# EAGLE design openmote32_2_0_1 (EAGLE 6.1)
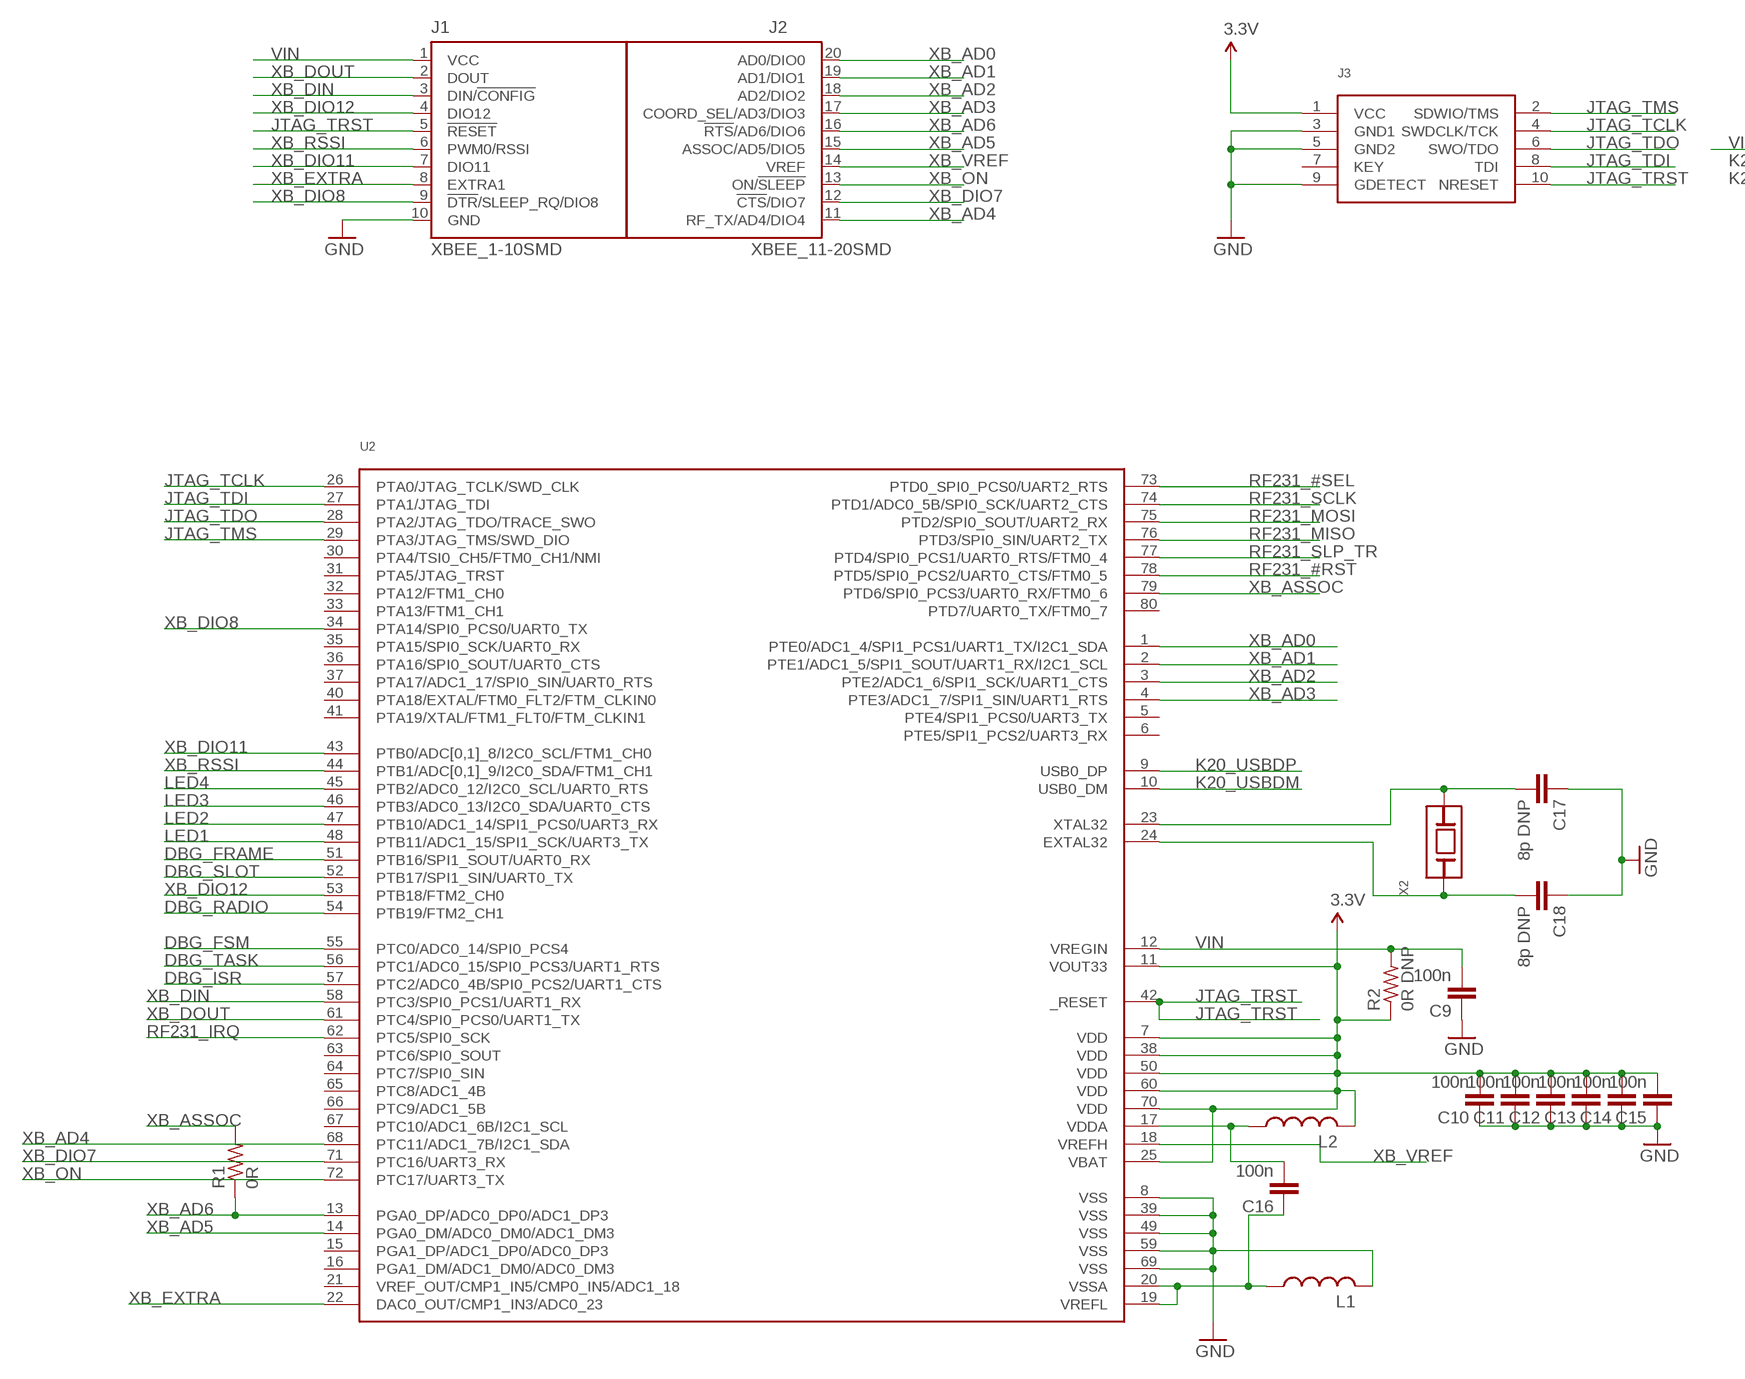
[diagram p0: schematic, sheet 1, part 1 of 2]
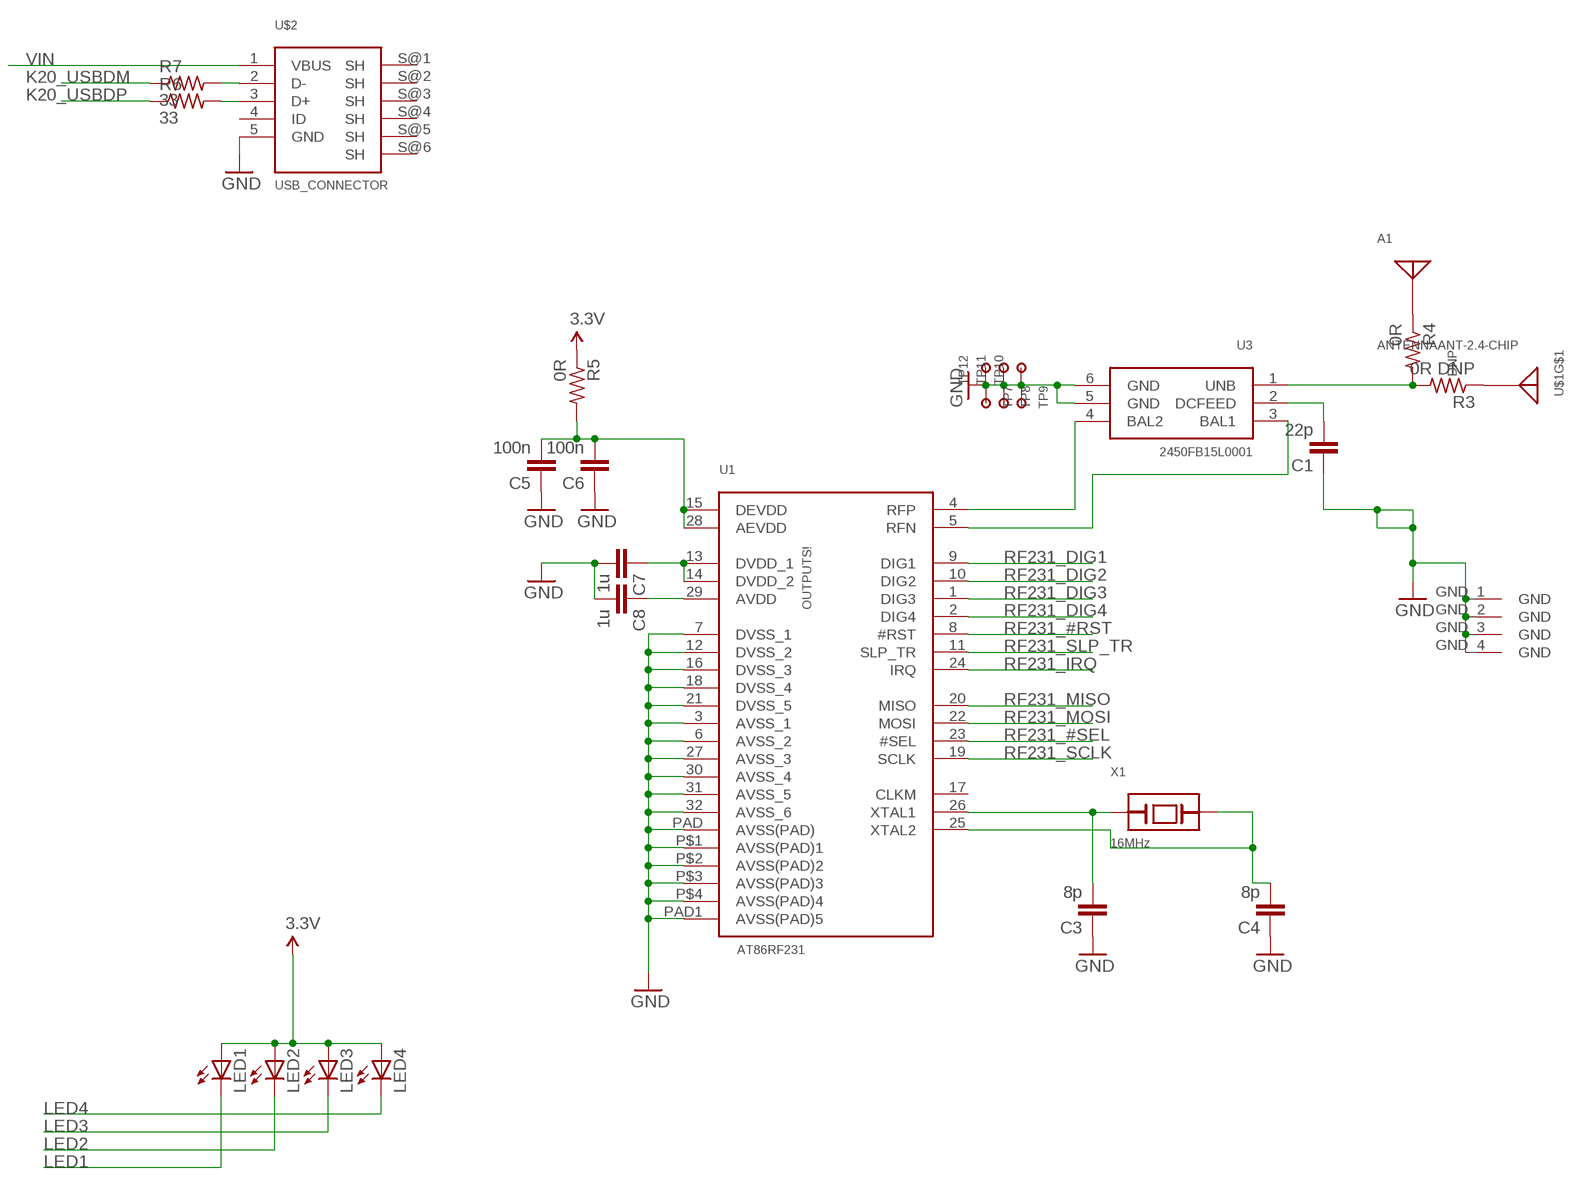
[diagram p1: schematic, sheet 1, part 2 of 2]

## Parts
A1  ANTENNAANT-2.4-CHIP  [ANT-2.4-CHP]
C1  22p  CAP0402  [C0402]
C3  8p  CAP0402  [C0402]
C4  8p  CAP0402  [C0402]
C5  100n  CAP0402  [C0402]
C6  100n  CAP0402  [C0402]
C7  1u  CAP0402  [C0402]
C8  1u  CAP0402  [C0402]
C9  100n  CAP0402  [C0402]
C10  100n  CAP0402  [C0402]
C11  100n  CAP0402  [C0402]
C12  100n  CAP0402  [C0402]
C13  100n  CAP0402  [C0402]
C14  100n  CAP0402  [C0402]
C15  100n  CAP0402  [C0402]
C16  100n  CAP0402  [C0402]
C17  8p DNP  CAP0402  [C0402]
C18  8p DNP  CAP0402  [C0402]
J1  XBEE_1-10SMD  [XBEE_1-10+SMD]
J2  XBEE_11-20SMD  [XBEE_11-20+SMD]
J3  JTAG_CONNECTOR  [SMD-050-HEADER-2X5]
L1  L-USL0402  [L0402]
L2  L-USL0402  [L0402]
LED1  LEDCHIPLED_0603  [CHIPLED_0603]
LED2  LEDCHIPLED_0603  [CHIPLED_0603]
LED3  LEDCHIPLED_0603  [CHIPLED_0603]
LED4  LEDCHIPLED_0603  [CHIPLED_0603]
R1  0R  R-US_R0402  [R0402]
R2  0R DNP  R-US_R0402  [R0402]
R3  0R DNP  R-US_R0402  [R0402]
R4  0R  R-US_R0402  [R0402]
R5  0R  R-US_R0402  [R0402]
R6  33  R-US_R0402  [R0402]
R7  33  R-US_R0402  [R0402]
TP7  TESTPOINTSMALLEST  [TESTPOINT]
TP8  TESTPOINTSMALLEST  [TESTPOINT]
TP9  TESTPOINTSMALLEST  [TESTPOINT]
TP10  TESTPOINTSMALLEST  [TESTPOINT]
TP11  TESTPOINTSMALLEST  [TESTPOINT]
TP12  TESTPOINTSMALLEST  [TESTPOINT]
U1  AT86RF231  [ATRF231_32QN2]
U2  K20_80PIN  [K20_LQFP80]
U3  2450FB15L0001  [2450FB15L0001]
U$1  DNP  ANTENNA_W_GROUNDS  [CONREVSMA003.031]
U$2  USB_CONNECTOR  [MICROUSB_10118192]
X1  16MHz  XTALCX3225SA  [CX3225SA]
X2  XTALABS07  [ABS07]

## Nets
3.3V [Power]: C10.2 C11.2 C12.2 C13.2 C14.2 C15.2 J3.1(VCC) L2.2 LED1.A LED2.A LED3.A LED4.A R2.1 R5.1 U2.7(VDD) U2.11(VOUT33) U2.25(VBAT) U2.38(VDD) U2.50(VDD) U2.60(VDD) U2.70(VDD)
DBG_FRAME: U2.51(PTB16/SPI1_SOUT/UART0_RX)
DBG_FSM: U2.55(PTC0/ADC0_14/SPI0_PCS4)
DBG_ISR: U2.57(PTC2/ADC0_4B/SPI0_PCS2/UART1_CTS)
DBG_RADIO: U2.54(PTB19/FTM2_CH1)
DBG_SLOT: U2.52(PTB17/SPI1_SIN/UART0_TX)
DBG_TASK: U2.56(PTC1/ADC0_15/SPI0_PCS3/UART1_RTS)
GND [Power]: C1.1 C3.1 C4.1 C5.1 C6.1 C7.2 C8.2 C9.1 C10.1 C11.1 C12.1 C13.1 C14.1 C15.1 C17.1 C18.1 J1.10(GND) J3.3(GND1) J3.5(GND2) J3.9(GDETECT) L1.2 TP7.P$1 TP8.P$1 TP9.P$1 TP10.P$1 TP11.P$1 TP12.P$1 U1.3(AVSS_1) U1.6(AVSS_2) U1.7(DVSS_1) U1.12(DVSS_2) U1.16(DVSS_3) U1.18(DVSS_4) U1.21(DVSS_5) U1.27(AVSS_3) U1.30(AVSS_4) U1.31(AVSS_5) U1.32(AVSS_6) U1.P$1(AVSS(PAD)1) U1.P$2(AVSS(PAD)2) U1.P$3(AVSS(PAD)3) U1.P$4(AVSS(PAD)4) U1.PAD1(AVSS(PAD)5) U1.PAD(AVSS(PAD)) U2.8(VSS) U2.39(VSS) U2.49(VSS) U2.59(VSS) U2.69(VSS) U3.5(GND) U3.6(GND) U$1.GND_1 U$1.GND_2 U$1.GND_3 U$1.GND_4 U$2.5(GND)
JTAG_TCLK: J3.4(SWDCLK/TCK) U2.26(PTA0/JTAG_TCLK/SWD_CLK)
JTAG_TDI: J3.8(TDI) U2.27(PTA1/JTAG_TDI)
JTAG_TDO: J3.6(SWO/TDO) U2.28(PTA2/JTAG_TDO/TRACE_SWO)
JTAG_TMS: J3.2(SDWIO/TMS) U2.29(PTA3/JTAG_TMS/SWD_DIO)
JTAG_TRST: J1.5(!RESET) J3.10(NRESET) U2.42(_RESET)
K20_USBDM: R7.1 U2.10(USB0_DM)
K20_USBDP: R6.1 U2.9(USB0_DP)
LED1: LED1.C U2.48(PTB11/ADC1_15/SPI1_SCK/UART3_TX)
LED2: LED2.C U2.47(PTB10/ADC1_14/SPI1_PCS0/UART3_RX)
LED3: LED3.C U2.46(PTB3/ADC0_13/I2C0_SDA/UART0_CTS)
LED4: LED4.C U2.45(PTB2/ADC0_12/I2C0_SCL/UART0_RTS)
N$1: U1.4(RFP) U3.4(BAL2)
N$2: U1.5(RFN) U3.3(BAL1)
N$3: R3.2 R4.2 U3.1(UNB)
N$4: C1.2 U3.2(DCFEED)
N$5: R6.2 U$2.3(D+)
N$6: C3.2 U1.26(XTAL1) X1.3(A)
N$7: C4.2 U1.25(XTAL2) X1.1(B)
N$8: C18.2 U2.24(EXTAL32) X2.1(A)
N$9: C8.1 U1.29(AVDD)
N$10: C7.1 U1.13(DVDD_1) U1.14(DVDD_2)
N$11: C17.2 U2.23(XTAL32) X2.2(B)
N$12: A1.CON R4.1
N$13: C16.1 L1.1 U2.19(VREFL) U2.20(VSSA)
N$15: R3.1 U$1.CON
N$16: C16.2 L2.1 U2.17(VDDA)
N$17 [Power]: C5.2 C6.2 R5.2 U1.15(DEVDD) U1.28(AEVDD)
N$18: R7.2 U$2.2(D-)
RF231_#RST: U1.8(#RST) U2.78(PTD5/SPI0_PCS2/UART0_CTS/FTM0_5)
RF231_#SEL: U1.23(#SEL) U2.73(PTD0_SPI0_PCS0/UART2_RTS)
RF231_DIG1: U1.9(DIG1)
RF231_DIG2: U1.10(DIG2)
RF231_DIG3: U1.1(DIG3)
RF231_DIG4: U1.2(DIG4)
RF231_IRQ: U1.24(IRQ) U2.62(PTC5/SPI0_SCK)
RF231_MISO: U1.20(MISO) U2.76(PTD3/SPI0_SIN/UART2_TX)
RF231_MOSI: U1.22(MOSI) U2.75(PTD2/SPI0_SOUT/UART2_RX)
RF231_SCLK: U1.19(SCLK) U2.74(PTD1/ADC0_5B/SPI0_SCK/UART2_CTS)
RF231_SLP_TR: U1.11(SLP_TR) U2.77(PTD4/SPI0_PCS1/UART0_RTS/FTM0_4)
VIN [Power]: C9.2 J1.1(VCC) R2.2 U2.12(VREGIN) U$2.1(VBUS)
XB_AD0: J2.20(AD0/DIO0) U2.1(PTE0/ADC1_4/SPI1_PCS1/UART1_TX/I2C1_SDA)
XB_AD1: J2.19(AD1/DIO1) U2.2(PTE1/ADC1_5/SPI1_SOUT/UART1_RX/I2C1_SCL)
XB_AD2: J2.18(AD2/DIO2) U2.3(PTE2/ADC1_6/SPI1_SCK/UART1_CTS)
XB_AD3: J2.17(COORD_SEL/AD3/DIO3) U2.4(PTE3/ADC1_7/SPI1_SIN/UART1_RTS)
XB_AD4: J2.11(RF_TX/AD4/DIO4) U2.68(PTC11/ADC1_7B/I2C1_SDA)
XB_AD5: J2.15(ASSOC/AD5/DIO5) U2.14(PGA0_DM/ADC0_DM0/ADC1_DM3)
XB_AD6: J2.16(!RTS!/AD6/DIO6) R1.1 U2.13(PGA0_DP/ADC0_DP0/ADC1_DP3)
XB_ASSOC: R1.2 U2.79(PTD6/SPI0_PCS3/UART0_RX/FTM0_6)
XB_DIN: J1.3(DIN/!CONFIG) U2.58(PTC3/SPI0_PCS1/UART1_RX)
XB_DIO7: J2.12(!CTS!/DIO7) U2.71(PTC16/UART3_RX)
XB_DIO8: J1.9(!DTR!/SLEEP_RQ/DIO8) U2.34(PTA14/SPI0_PCS0/UART0_TX)
XB_DIO11: J1.7(DIO11) U2.43(PTB0/ADC[0,1]_8/I2C0_SCL/FTM1_CH0)
XB_DIO12: J1.4(DIO12) U2.53(PTB18/FTM2_CH0)
XB_DOUT: J1.2(DOUT) U2.61(PTC4/SPI0_PCS0/UART1_TX)
XB_EXTRA: J1.8(EXTRA1) U2.22(DAC0_OUT/CMP1_IN3/ADC0_23)
XB_ON: J2.13(ON/!SLEEP) U2.72(PTC17/UART3_TX)
XB_RSSI: J1.6(PWM0/RSSI) U2.44(PTB1/ADC[0,1]_9/I2C0_SDA/FTM1_CH1)
XB_VREF: J2.14(VREF) U2.18(VREFH)
Unconnected: J3.7(KEY) U1.17(CLKM) U2.5(PTE4/SPI1_PCS0/UART3_TX) U2.6(PTE5/SPI1_PCS2/UART3_RX) U2.15(PGA1_DP/ADC1_DP0/ADC0_DP3) U2.16(PGA1_DM/ADC1_DM0/ADC0_DM3) U2.21(VREF_OUT/CMP1_IN5/CMP0_IN5/ADC1_18) U2.30(PTA4/TSI0_CH5/FTM0_CH1/NMI) U2.31(PTA5/JTAG_TRST) U2.32(PTA12/FTM1_CH0) U2.33(PTA13/FTM1_CH1) U2.35(PTA15/SPI0_SCK/UART0_RX) U2.36(PTA16/SPI0_SOUT/UART0_CTS) U2.37(PTA17/ADC1_17/SPI0_SIN/UART0_RTS) U2.40(PTA18/EXTAL/FTM0_FLT2/FTM_CLKIN0) U2.41(PTA19/XTAL/FTM1_FLT0/FTM_CLKIN1) U2.63(PTC6/SPI0_SOUT) U2.64(PTC7/SPI0_SIN) U2.65(PTC8/ADC1_4B) U2.66(PTC9/ADC1_5B) U2.67(PTC10/ADC1_6B/I2C1_SCL) U2.80(PTD7/UART0_TX/FTM0_7) U$2.4(ID) U$2.S@1(SH) U$2.S@2(SH) U$2.S@3(SH) U$2.S@4(SH) U$2.S@5(SH) U$2.S@6(SH)

## Library data of the parts
A1 = WSNlib:ANTENNA: Antennas ANT-2.4-CHP-x RPSMA connector
C1 C3-C18 = SparkFun:CAP: Capacitor Standard 0603 ceramic capacitor, and 0.1" leaded capacitor.
J1 = WSNlib:XBEE_1-10
J2 = WSNlib:XBEE_11-20
J3 = WSNlib:JTAG_CONNECTOR: Cortex Debug Connector http://www.keil.com/coresight/connectors.asp
L1 L2 = rcl_new:L-US: INDUCTOR, American symbol
LED1-LED4 = led:LED: LED OSRAM: - CHIPLED LG R971, LG N971, LY N971, LG Q971, LY Q971, LO R971, LY R971 LH N974, LH R974 LS Q976, LO Q976, LY Q976 LO Q996 - Hyper CHIPLED LW Q18S LB Q993, LB Q99A, LB R99A - SideLED LS A670, LO A670, LY A670, LG A670, LP A670 LB A673, LV A673, LT A673, LW A673 LH A674 LY A675 LS A676, LA A676, LO A676, LY A676, LW A676 LS A679, LY A679, LG A679 - Hyper Micro SIDELED® LS Y876, LA Y876, LO Y876, LY Y876 LT Y87S - SmartLED LW L88C, LW L88S LB L89C, LB L89S, LG L890 LS L89K, LO L89K, LY L89K LS L896, LA L896, LO L896, LY L896 - TOPLED LS T670, LO T670, LY T670, LG T670, LP T670 LSG T670, LSP T670, LSY T670, LOP T670, LYG T670 LG T671, LOG T671, LSG T671 LB T673, LV T673, LT T673, LW T673 LH T674 LS T676, LA T676, LO T676, LY T676, LB T676, LH T676, LSB T676, LW T676 LB T67C, LV T67C, LT T67C, LS T67K, LO T67K, LY T67K, LW E67C LS E67B, LA E67B, LO E67B, LY E67B, LB E67C, LV E67C, LT E67C LW T67C LS T679, LY T679, LG T679 LS T770, LO T770, LY T770, LG T770, LP T770 LB T773, LV T773, LT T773, LW T773 LH T774 LS E675, LA E675, LY E675, LS T675 LS T776, LA T776, LO T776, LY T776, LB T776 LHGB T686 LT T68C, LB T68C - Hyper Mini TOPLED® LB M676 - Mini TOPLED Santana® LG M470 LS M47K, LO M47K, LY M47K Source: http://www.osram.convergy.de LUXEON: - LUMILED® LXK2-PW12-R00, LXK2-PW12-S00, LXK2-PW14-U00, LXK2-PW14-V00 LXK2-PM12-R00, LXK2-PM12-S00, LXK2-PM14-U00 LXK2-PE12-Q00, LXK2-PE12-R00, LXK2-PE12-S00, LXK2-PE14-T00, LXK2-PE14-U00 LXK2-PB12-K00, LXK2-PB12-L00, LXK2-PB12-M00, LXK2-PB14-N00, LXK2-PB14-P00, LXK2-PB14-Q00 LXK2-PR12-L00, LXK2-PR12-M00, LXK2-PR14-Q00, LXK2-PR14-R00 LXK2-PD12-Q00, LXK2-PD12-R00, LXK2-PD12-S00 LXK2-PH12-R00, LXK2-PH12-S00 LXK2-PL12-P00, LXK2-PL12-Q00, LXK2-PL12-R00 Source: www.luxeon.com KINGBRIGHT: KA-3528ASYC Source: www.kingbright.com
R1-R7 = rcl:R-US_: RESISTOR, American symbol
TP7-TP12 = WSNlib:TESTPOINT: Generic Testpoint
U1 = WSNlib:AT86RF231: ATRF231 Radio Tranciever
U2 = WSNlib:K20_80PIN: K20 80-pin LQFP Device
U3 = WSNlib:2450FB15L0001
U$1 = WSNlib:ANTENNA_W_GROUNDS: 4 Grounds added to antenna symbol
U$2 = WSNlib:USB_CONNECTOR
X1 X2 = WSNlib:XTAL: Crystals used in OpenMote

## Net classes
0 default: width 0.152 mm, drill 0.203 mm, clearance 0.152 mm
1 RF: width 0.254 mm, drill 2.54 mm, clearance 0.152 mm
2 Power: width 0.203 mm, drill 0.203 mm, clearance 0.152 mm

## Board
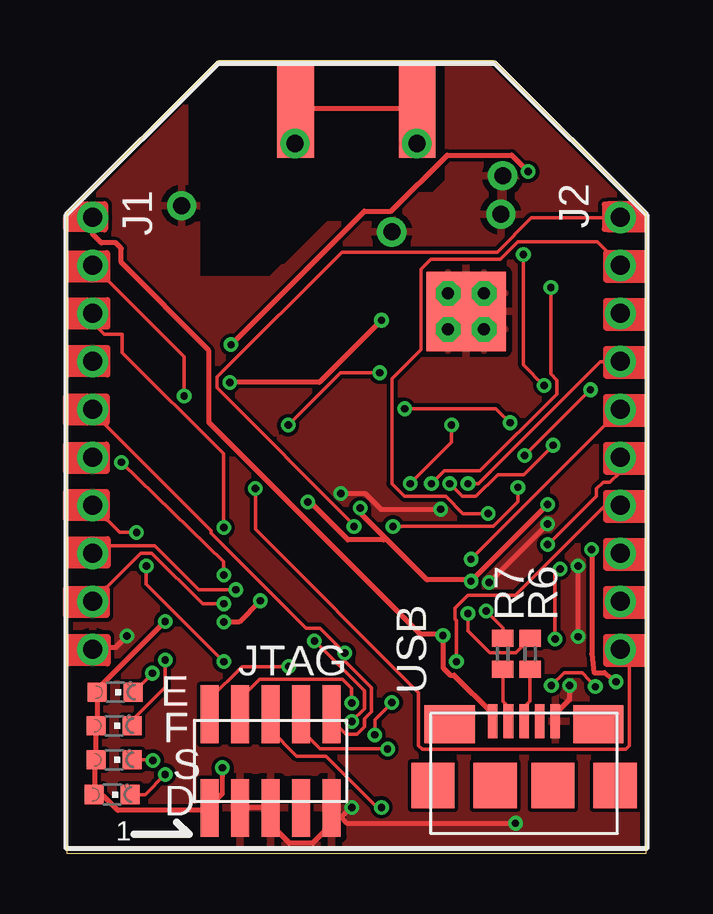
[diagram p2: board, top side]
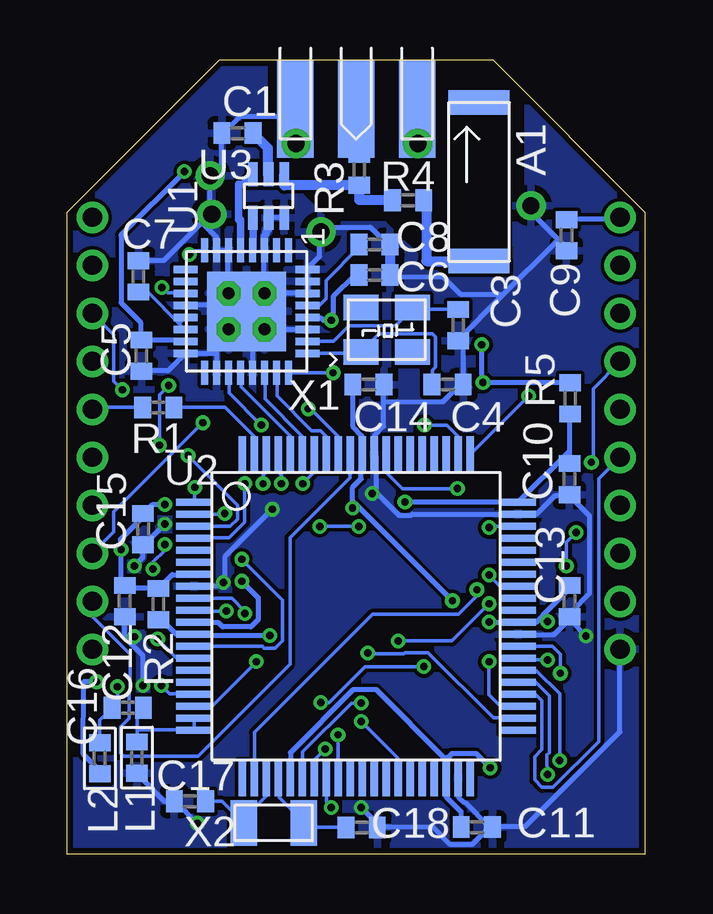
[diagram p3: board, bottom side, seen from below]

Size 24.12 x 33.07 mm. Coordinates in mm from the lower left corner, seen from the top.
Outline: 24.12,0 0,0 0,26.71 6.33,33.06 6.34,33.07 17.77,33.07 24.12,26.71 24.12,0
Copper layers (1*16): Top 0.035mm / dielectric 1.5mm / Bottom 0.035mm
Design rules: minimum track width 6mil, minimum drill 12mil, track to track 6mil, track to pad 6mil, pad to pad 6mil, via to via 6mil, smd to smd 0mil, copper to edge 10mil, drill to drill 10mil, minimum pad ring 10mil, minimum via ring 6mil, stop-mask expansion 2mil, vias tented up to drill 100mil, thermal gap 10mil

### Footprints (pad centres in the part's own frame; a part is rotated, then mirrored left to right if it is on the bottom)
ANT-2.4-CHP = smd 1.016 x 2.54: CON -3.302,0; MEC 3.302,0
C0402 = smd 0.7 x 0.9: 1 -0.65,0; 2 0.65,0
XBEE_1-10+SMD = drill 0.8 pad 1.27: 1 -11,9; 2 -11,7; 3 -11,5; 4 -11,3; 5 -11,1; 6 -11,-1; 7 -11,-3; 8 -11,-5; 9 -11,-7; 10 -11,-9
XBEE_11-20+SMD = drill 0.8 pad 1.27: 11 11,-9; 12 11,-7; 13 11,-5; 14 11,-3; 15 11,-1; 16 11,1; 17 11,3; 18 11,5; 19 11,7; 20 11,9
SMD-050-HEADER-2X5 = smd 0.76 x 2.4: 1 -2.54,-1.95; 2 -2.54,1.95; 3 -1.27,-1.95; 4 -1.27,1.95; 5 0,-1.95; 6 0,1.95; 7 1.27,-1.95; 8 1.27,1.95; 9 2.54,-1.95; 10 2.54,1.95
L0402 = smd 0.7 x 0.9: 1 -0.65,0; 2 0.65,0
CHIPLED_0603 = smd 0.8 x 0.8: A 0,-0.75; C 0,0.75
R0402 = smd 0.7 x 0.9: 1 -0.65,0; 2 0.65,0
TESTPOINT = drill 0.711 pad 1.016: P$1 0,0
ATRF231_32QN2 = smd 1 x 0.3: 1 -2.55,1.75; 2 -2.55,1.25; 3 -2.55,0.75; 4 -2.55,0.25; 5 -2.55,-0.25; 6 -2.55,-0.75; 7 -2.55,-1.25; 8 -2.55,-1.75; 17 2.55,-1.75; 18 2.55,-1.25; 19 2.55,-0.75; 20 2.55,-0.25; 21 2.55,0.25; 22 2.55,0.75; 23 2.55,1.25; 24 2.55,1.75 | smd 0.3 x 1: 9 -1.75,-2.55; 10 -1.25,-2.55; 11 -0.75,-2.55; 12 -0.25,-2.55; 13 0.25,-2.55; 14 0.75,-2.55; 15 1.25,-2.55; 16 1.75,-2.55; 25 1.75,2.55; 26 1.25,2.55; 27 0.75,2.55; 28 0.25,2.55; 29 -0.25,2.55; 30 -0.75,2.55; 31 -1.25,2.55; 32 -1.75,2.55 | drill 0.5 octagon: P$1 -0.75,0.75; P$2 0.75,0.75; P$3 0.75,-0.75; P$4 -0.75,-0.75 | smd 3.3 x 3.3 bottom: PAD 0,0 | smd 3.3 x 3.3: PAD1 0,0
K20_LQFP80 = smd 1.5 x 0.3: 1 -6.75,4.75; 2 -6.75,4.25; 3 -6.75,3.75; 4 -6.75,3.25; 5 -6.75,2.75; 6 -6.75,2.25; 7 -6.75,1.75; 8 -6.75,1.25; 9 -6.75,0.75; 10 -6.75,0.25; 11 -6.75,-0.25; 12 -6.75,-0.75; 13 -6.75,-1.25; 14 -6.75,-1.75; 15 -6.75,-2.25; 16 -6.75,-2.75; 17 -6.75,-3.25; 18 -6.75,-3.75; 19 -6.75,-4.25; 20 -6.75,-4.75; 41 6.75,-4.75; 42 6.75,-4.25; 43 6.75,-3.75; 44 6.75,-3.25; 45 6.75,-2.75; 46 6.75,-2.25; 47 6.75,-1.75; 48 6.75,-1.25; 49 6.75,-0.75; 50 6.75,-0.25; 51 6.75,0.25; 52 6.75,0.75; 53 6.75,1.25; 54 6.75,1.75; 55 6.75,2.25; 56 6.75,2.75; 57 6.75,3.25; 58 6.75,3.75; 59 6.75,4.25; 60 6.75,4.75 | smd 0.3 x 1.5: 21 -4.75,-6.75; 22 -4.25,-6.75; 23 -3.75,-6.75; 24 -3.25,-6.75; 25 -2.75,-6.75; 26 -2.25,-6.75; 27 -1.75,-6.75; 28 -1.25,-6.75; 29 -0.75,-6.75; 30 -0.25,-6.75; 31 0.25,-6.75; 32 0.75,-6.75; 33 1.25,-6.75; 34 1.75,-6.75; 35 2.25,-6.75; 36 2.75,-6.75; 37 3.25,-6.75; 38 3.75,-6.75; 39 4.25,-6.75; 40 4.75,-6.75; 61 4.75,6.75; 62 4.25,6.75; 63 3.75,6.75; 64 3.25,6.75; 65 2.75,6.75; 66 2.25,6.75; 67 1.75,6.75; 68 1.25,6.75; 69 0.75,6.75; 70 0.25,6.75; 71 -0.25,6.75; 72 -0.75,6.75; 73 -1.25,6.75; 74 -1.75,6.75; 75 -2.25,6.75; 76 -2.75,6.75; 77 -3.25,6.75; 78 -3.75,6.75; 79 -4.25,6.75; 80 -4.75,6.75
2450FB15L0001 = smd 1 x 0.4: 1 -0.9,0.65; 2 -0.9,0; 3 -0.9,-0.65; 4 0.9,-0.65; 5 0.9,0; 6 0.9,0.65
CONREVSMA003.031 = smd 1.524 x 4.064: CON 0,0; GND_2 -2.54,0; GND_4 2.54,0 | smd 1.524 x 4.064 bottom: GND_1 -2.54,0; GND_3 2.54,0
MICROUSB_10118192 = smd 0.4 x 1.4: 1 -1.3,2.675; 2 -0.65,2.675; 3 0,2.675; 4 0.65,2.675; 5 1.3,2.675 | smd 2.1 x 1.6: S@1 -3.1,2.55; S@2 3.1,2.55 | smd 1.8 x 1.9: S@3 -3.8,0; S@4 -1.2,0; S@5 1.2,0; S@6 3.8,0
CX3225SA = smd 1.45 x 1.05: 1 -1.075,-0.925; 2 1.075,-0.925; 3 1.075,0.925; 4 -1.075,0.925
ABS07 = smd 1.1 x 1.9: 1 -1.25,0; 2 1.25,0

### Placement (x,y rotation side)
A1  6.93,27.99 90 bottom
C1  17.01,30.02 0 bottom
C3  7.8,22.02 90 bottom
C4  8.24,19.55 180 bottom
C5  21.01,20.75 90 bottom
C6  11.29,24.12 180 bottom
C7  21.13,24.05 90 bottom
C8  11.29,25.39 0 bottom
C9  3.29,25.77 90 bottom
C10  3.16,15.61 90 bottom
C11  7.02,1.1 180 bottom
C12  21.7,10.53 90 bottom
C13  3.16,10.53 90 bottom
C14  11.54,19.55 180 bottom
C15  20.94,13.53 90 bottom
C16  21.58,6.08 180 bottom
C17  18.99,2.18 0 bottom
C18  11.82,1.09 180 bottom
J1  12.05,17.51 0 top
J2  12.05,17.51 0 top
J3  8.47,3.86 0 top
L1  21.2,4 270 bottom
L2  22.75,3.98 270 bottom
LED1  1.99,6.73 270 top
LED2  1.94,5.33 270 top
LED3  1.94,3.91 270 top
LED4  1.87,2.46 270 top
R1  20.31,18.59 0 bottom
R2  20.31,10.4 270 bottom
R3  11.93,28.5 270 bottom
R4  9.89,27.23 180 bottom
R5  3.14,18.97 90 bottom
R6  19.29,8.33 270 top
R7  18.15,8.33 270 top
TP7  13.53,25.91 0 top
TP8  18.07,26.64 0 top
TP9  18.15,28.24 0 top
TP10  4.76,27 0 top
TP11  9.49,29.59 0 top
TP12  14.57,29.59 0 top
U1  16.62,22.59 270 bottom
U2  12.05,9.89 0 bottom
U3  15.71,27.41 270 bottom
U$1  12.05,31.04 0 bottom
U$2  19.04,2.84 0 top
X1  10.78,21.83 0 bottom
X2  15.49,1.28 180 bottom

### Tracks (layer width: path | path; a pad name or v marks a point on that pad's centre or on a via)
3.3V  (via drill 0.3)
  Top 0.203: v4.08,9.68 1.21,6.81 LED1.A 1.26,5.41 LED2.A 1.21,3.99 LED3.A 1.18,3.91 1.13,3.86 1.13,2.46 LED4.A 1.21,2.41 1.49,2.41 2.1,1.8 5.83,1.8 J3.1 5.96,2.01 6.46,2.51 v6.46,3.58 | v22.87,7.16 22.39,7.54 21.96,7.54 21.86,8.33 v21.86,12.67 | v20.03,14.55 v16.83,11.35 16.75,11.4 15,11.4 13.26,13.14 | v12.2,14.4 12.2,14.2 13.26,13.14 | v10.02,14.66 10.12,14.66 11.7,13.08 13.2,13.08 13.26,13.14 | v6.52,9.65 7.15,9.65 v8.04,10.54
  Bottom 0.203: C11.2 7.68,1.12 7.68,1.75 8.29,2.36 8.29,3.12 U2.38 8.34,3.23 8.34,3.96 | 8.34,3.96 11.21,6.83 12.18,6.83 14.8,4.22 U2.25 | 4.28,9.91 4.28,9.93 3.16,11.05 C13.2 | 4.28,9.91 4.53,9.65 U2.50 5.4,9.65 v6.52,9.65 | v4.08,9.68 4.23,9.83 4.28,9.91 | v6.46,3.58 7.05,4.17 8.06,4.17 8.22,4.01 8.27,4.01 8.34,3.96 | 3.16,16.71 3.16,18.29 R5.1 | 3.16,16.71 3.16,16.28 C10.2 | 3.16,16.71 3.24,16.71 5.3,14.66 U2.60 5.4,14.66 v10.02,14.66 | C14.2 12.18,19.53 12.18,17.78 11.82,17.42 11.82,16.66 U2.70 11.85,16.56 11.85,15.62 12.2,15.27 v12.2,14.4 12.13,14.63 v8.04,10.54 | v22.87,7.16 23.43,7.16 23.46,4.17 22.75,3.45 L2.2 | v16.83,11.35 16.14,10.67 16.14,9.75 16.45,9.45 17.62,9.45 17.79,9.63 18.78,9.63 U2.11 | v20.03,14.55 20.54,14.55 20.87,14.22 C15.2 20.94,14.05 21.88,13.11 21.88,12.52 v21.86,12.67 21.86,11.48 21.73,11.28 C12.2 21.6,11.07 20.31,11.07 R2.1 20.23,11.12 19.72,11.63 18.81,11.63 U2.7
GND  (via drill 0.3)
  Top 0.203: J3.3 J3.5 8.52,1.83 8.52,1.17 9.26,0.43 10.22,0.43 11.29,1.5 J3.9 11.4,1.51 | v18.68,1.27 11.65,1.27 11.4,1.51 | J1.10 | v11.85,1.93 11.82,1.93 11.47,1.57 11.4,1.51 | TP11.P$1 9.49,31.01 U$1.GND_3 9.59,31.04 14.49,31.04 U$1.GND_1 14.57,31.01 TP12.P$1 | U1.PAD1 U1.P$1 | v20.94,7.01 20.94,6.43 20.36,5.84 20.36,5.54 U$2.5 | v21.3,9.04 v21.3,11.99 | v20.03,13.74 v17.59,11.3 | v15.56,14.35 13.07,14.35 12.41,15.01 v11.39,15.01 | v2.48,9.07 1.99,8.58 1.13,8.58 J1.10
  Bottom 0.203: L1.2 21.2,3.33 20.05,2.18 C17.1 19.55,2.13 v18.68,1.27 | C11.1 6.39,1.12 6.52,1.12 7.53,2.13 7.56,2.13 7.79,2.36 7.79,3.12 U2.39 | C11.1 6.57,1.04 7.23,0.38 8.12,0.38 8.83,1.09 11.16,1.09 C18.1 11.09,1.17 v11.85,1.93 | J1.10 1.05,5.08 4.99,1.14 6.29,1.14 C11.1 | U$1.GND_3 9.51,29.62 TP11.P$1 | TP12.P$1 14.59,29.62 U$1.GND_1 14.67,30.73 16.9,30.73 17.56,30.07 C1.1 17.67,28.73 TP9.P$1 18.15,28.17 18.15,26.72 TP8.P$1 | TP8.P$1 18.15,26.64 20.08,24.71 21.12,24.71 C7.2 | TP8.P$1 18.43,26.24 17.87,25.68 17.87,25.25 U1.7 U1.6 17.39,25.04 17.39,23.44 U1.P$4 | C8.2 10.83,25.48 11.47,26.11 13.32,26.11 TP7.P$1 13.58,25.83 13.58,24.89 14.03,24.43 U1.32 14.08,24.33 14.08,23.93 U1.31 14.08,23.82 14.08,23.37 U1.30 14.19,23.37 15.79,23.37 U1.PAD1 | C5.1 20.99,20.12 19.9,20.12 19.19,20.83 U1.16 19.09,20.83 17.95,20.83 17.87,20.83 | U3.6 15.08,26.52 15.58,26.52 U3.5 | U1.27 15.86,21.84 U1.PAD1 | U1.21 16.37,20.07 16.37,22.22 U1.PAD1 | 17.87,20.83 17.87,21.34 17.39,21.82 U1.PAD1 | 17.87,20.83 17.87,20.07 U1.18 | U1.P$4 17.87,22.86 19.16,22.86 U1.12 | U1.P$4 U1.PAD1 | U1.3 15.89,24.99 15.89,23.37 U1.PAD1 | U1.P$2 U1.PAD1 | U1.P$1 U1.PAD1 | U1.P$3 U1.PAD1 | U1.P$4 U1.PAD1 | 21.51,8.83 20.94,8.25 v20.94,7.01 | 21.51,8.83 21.7,9.02 21.7,9.85 C12.1 | v21.3,11.99 20.94,12.34 20.94,12.85 C15.1 20.87,12.9 v20.03,13.74 | v21.3,9.04 21.45,8.89 21.51,8.83 | U2.8 18.78,11.15 17.74,11.15 v17.59,11.3 17.54,11.38 17.54,12.37 v15.56,14.35 | C13.1 3.16,9.85 3.16,9.78 3.82,9.12 5.3,9.12 U2.49 | C13.1 3.11,9.96 3.11,10.06 2.32,10.85 2.32,14.07 3.11,14.86 C10.1 3.16,14.93 3.75,14.93 4.53,14.15 U2.59 5.4,14.15 9.72,14.15 9.77,14.1 10.27,14.1 11.24,15.06
  Bottom 0.203: 3.63,25.59 4.76,26.72 TP10.P$1 | 3.63,25.59 3.29,25.25 C9.1 | 10.91,18.82 10.91,17.81 11.29,17.42 11.29,16.66 U2.69 11.24,16.56 11.24,15.06 | 10.91,18.82 10.91,19.53 C14.1 | 10.91,18.82 10.83,18.82 8.45,18.82 7.71,19.56 C4.1 7.61,19.56 7.61,21.18 7.79,21.36 C3.1 7.76,21.46 5.99,23.23 | 5.99,23.23 3.7,25.53 3.63,25.59 | v11.39,15.01 11.32,15.01 11.24,15.06 | C6.1 10.45,24.03 8.42,24.03 7.68,23.29 6.06,23.29 5.99,23.23 | v2.48,9.07 3.11,9.7 C13.1
  Bottom 0.305: U3.5 15.71,26.01 15.81,25.91 15.81,25.83 15.89,25.73 15.89,25.18 U1.3
  Bottom 0.406: C8.2 C6.1
  pour Top: -0.01,0.3 -0.01,26.6 4.89,31.5 4.89,27.9 5.39,27.4 5.39,24 5.49,23.9 8.49,23.9 8.99,24.4 9.09,24.4 10.89,26.2 12.79,26.2 13.09,26.5 13.49,26.5 14.39,27.4 15.29,27.4 15.89,28 15.89,32.9 15.99,33 17.79,33 24.19,26.6 24.19,0 0.29,0
  pour Bottom: -0.01,0.3 -0.01,26.6 4.89,31.5 4.89,27.9 5.39,27.4 5.39,24 5.49,23.9 8.49,23.9 8.99,24.4 9.09,24.4 10.89,26.2 12.79,26.2 13.09,26.5 13.49,26.5 14.39,27.4 15.29,27.4 15.89,28 15.89,32.9 15.99,33 17.79,33 24.19,26.6 24.19,0 0.29,0
JTAG_TCLK  (via drill 0.3)
  Top 0.152: v11.85,6.27 11.85,6.88 11.47,7.26 8.01,7.26 7.2,6.45 J3.4
  Bottom 0.152: v11.85,6.27 12.26,6.27 14.29,4.24 U2.26
JTAG_TDI  (via drill 0.3)
  Top 0.152: v13.35,4.37 10.53,4.37 9.74,5.16 9.74,5.79 J3.8
  Bottom 0.152: v13.35,4.37 13.78,3.94 13.78,3.15 U2.27
JTAG_TDO  (via drill 0.3)
  Top 0.152: v13.09,1.93 12.92,1.93 10.78,4.06 9.56,4.06 8.47,5.16 8.47,5.79 J3.6
  Bottom 0.152: v13.09,1.93 13.3,2.13 13.3,3.12 U2.28
JTAG_TMS  (via drill 0.3)
  Top 0.152: v12.81,4.95 12.81,5.59 v13.53,6.3 | v9.23,7.8 7.28,7.8 5.93,6.45 J3.2
  Bottom 0.152: v12.81,4.95 12.81,3.15 U2.29 | v13.53,6.3 13.2,6.3 11.7,7.8 v9.23,7.8
JTAG_TRST  (via drill 0.3)
  Top 0.152: J3.10 11.01,5.79 11.01,5.59 11.62,4.98 12.08,4.98 12.38,5.28 12.38,5.61 12.69,5.92 12.69,6.91 11.57,8.03 v11.57,8.36 11.52,8.41 10.53,9.4 9.94,9.4 5.98,13.36 5.98,13.46 1.05,18.39 1.05,18.49 J1.5
  Bottom 0.152: v11.57,8.36 11.54,8.33 10.07,8.33 10.02,8.38 9.06,8.38 6.34,5.66 5.32,5.66 U2.42
K20_USBDM  (via drill 0.3)
  Top 0.152: v17.46,10.11 18.15,9.42 R7.1
  Bottom 0.152: v17.46,10.11 18.76,10.11 18.78,10.13 U2.10
K20_USBDP  (via drill 0.3)
  Top 0.152: v16.7,10.01 16.7,9.3 17.62,8.38 18.71,8.38 19.29,8.97 R6.1
  Bottom 0.152: v16.7,10.01 16.7,10.11 17.23,10.64 18.78,10.64 U2.9
LED1  (via drill 0.3)
  Top 0.152: v3.54,7.52 LED1.C
  Bottom 0.152: v3.54,7.52 3.54,8.31 3.87,8.64 U2.48
LED2  (via drill 0.3)
  Top 0.152: v4.08,8.08 4.08,6.93 2.71,5.56 LED2.C
  Bottom 0.152: v4.08,8.08 5.25,8.08 5.3,8.13 U2.47
LED3  (via drill 0.3)
  Top 0.152: v3.57,3.89 3.54,3.91 LED3.C
  Bottom 0.152: v3.57,3.89 3.57,6.65 4.53,7.62 5.3,7.62 U2.46
LED4  (via drill 0.3)
  Top 0.152: v4.08,3.3 3.24,2.46 2.63,2.46 LED4.C
  Bottom 0.152: v4.08,3.3 4.08,3.63 4.1,3.66 4.1,4.11 4,4.22 4,6.58 4.56,7.14 U2.45
N$1
  Bottom 0.305: U3.4 16.36,25.16 U1.4
N$2
  Bottom 0.305: U1.5 16.88,26.42 16.95,26.42 16.95,27.89 16.78,27.89 U3.3
N$3
  Bottom 0.406: R4.2 11.93,27.23 R3.2 15.06,27.85 U3.1
N$4
  Bottom 0.406: U3.2 15.74,28.31 15.74,29.4 C1.2
N$5
  Top 0.152: R6.2 19.29,7.67 19.29,6.35 19.04,6.1 19.04,5.54 U$2.3
N$6
  Bottom 0.152: C3.2 7.81,22.68 9.64,22.68 9.69,22.73 X1.3 9.74,22.68 10.43,22 12.36,22 12.99,21.36 14.06,21.36 U1.26
N$7
  Bottom 0.152: C4.2 8.88,19.56 8.88,20.14 8.75,20.27 8.75,21.54 8.88,21.67 11.11,21.67 11.85,20.93 X1.1 11.9,20.85 14.06,20.85 U1.25
N$8
  Bottom 0.152: C18.2 14.06,1.09 14.24,1.27 X2.1 14.26,1.35 15.28,2.36 15.28,3.12 U2.24
N$9
  Bottom 0.152: C8.1 11.95,25.37 11.95,25.25 13.32,23.88 13.32,23.11 13.58,22.86 14.06,22.86 U1.29
N$10
  Bottom 0.152: 19.43,22.08 19.19,21.84 U1.14 | 19.43,22.08 20.74,23.39 21.12,23.39 C7.1 | U1.13 19.19,22.33 19.39,22.12 19.43,22.08
N$11
  Bottom 0.152: C17.2 18.33,2.18 17.64,2.18 X2.2 16.78,1.42 15.81,2.39 15.81,3.12 U2.23
N$12
  Bottom 0.406: R4.1 9.13,27.23 9.13,24.69 A1.CON
N$13
  Bottom 0.152: 21.2,5.16 21.2,5.82 20.94,6.07 C16.1 | 21.2,5.16 21.2,4.67 L1.1 | 21.2,5.16 21.15,5.16 18.81,5.16 U2.20 18.81,5.23 18.81,5.64 U2.19
N$15
  Bottom 0.406: R3.1 11.93,30.91 U$1.CON
N$16  (via drill 0.3)
  Top 0.152: v20.18,7.01 20.71,7.54 21.48,7.54 v22.01,6.96
  Bottom 0.152: L2.1 22.75,4.65 22.75,5.56 22.24,6.07 C16.2 22.19,6.15 22.01,6.32 v22.01,6.96 | v20.18,7.01 19.82,6.65 18.81,6.65 U2.17
N$17  (via drill 0.3)
  Top 0.203: v6.77,19.63 10.5,19.63 v13.09,22.22 | v19.22,28.42 18.53,29.11 15.84,29.11 13.5,26.77 12.38,26.77 v6.82,21.21
  Bottom 0.203: U1.15 19.19,21.36 19.22,21.39 20.99,21.39 C5.2 21.04,21.49 21.04,22.15 21.86,22.96 21.86,25.78 v19.22,28.42 | R5.2 v6.77,19.63 6.82,19.71 v6.82,21.21 | U1.28 14.06,22.33 13.53,22.33 13.42,22.22 v13.09,22.22 13.04,22.3 12.99,22.35 12.99,23.24 12.13,24.1 11.95,24.1 C6.2
N$18
  Top 0.152: R7.2 18.15,7.67 18.15,6.35 18.38,6.12 18.38,5.54 U$2.2
RF231_#RST  (via drill 0.3)
  Top 0.152: v19.01,24.97 19.01,20.37 v19.88,19.51 | v20.26,17.02 19.04,15.8 17.95,15.8 17.03,14.88 16.47,14.88 v15.94,15.42
  Bottom 0.152: v19.01,24.97 18.86,25.12 18.38,25.12 U1.8 | v19.88,19.51 20.26,19.13 v20.26,17.02 | v15.94,15.42 15.94,15.77 15.81,15.9 15.81,16.64 U2.78
RF231_#SEL
  Bottom 0.152: U1.23 15.35,20.04 15.35,19.08 13.91,17.63 13.55,17.63 13.32,17.4 13.32,16.66 U2.73
RF231_IRQ  (via drill 0.3)
  Top 0.152: v13.02,20.04 11.39,20.04 v9.21,17.86
  Bottom 0.152: v13.02,20.04 U1.24 | v9.21,17.86 8.27,17.86 7.81,17.4 7.81,16.66 U2.62
RF231_MISO
  Bottom 0.152: U1.20 16.85,20.04 16.85,19.46 14.82,17.42 14.82,16.66 U2.76
RF231_MOSI
  Bottom 0.152: U1.22 15.86,20.04 15.86,18.95 14.31,17.4 14.31,16.66 U2.75
RF231_SCLK  (via drill 0.3)
  Top 0.152: v16.01,17.86 16.01,17.14 v14.29,15.42
  Bottom 0.152: v16.01,17.86 17.36,19.2 17.36,20.04 U1.19 | v14.29,15.42 13.81,15.9 U2.74
RF231_SLP_TR  (via drill 0.3)
  Top 0.152: v20.16,23.6 20.16,19.99 20.41,19.74 20.41,19.15 17.21,15.95 15.71,15.95 v15.18,15.42
  Bottom 0.152: v20.16,23.6 19.93,23.37 19.19,23.37 U1.11 | v15.18,15.42 15.18,15.77 15.28,15.87 15.28,16.64 U2.77
VIN  (via drill 0.3)
  Top 0.203: U$2.1 17.72,5.54 17.72,5.84 16.12,7.44 15.96,7.44 15.66,7.75 v15.66,9.09 15.58,9.14 14.72,9.14 5.91,17.96 5.91,20.95 2.25,24.64 2.25,25.22 2.02,25.45 1.41,25.45 1.05,25.81 1.05,26.49 J1.1
  Bottom 0.203: C9.2 3.29,26.44 1.11,26.44 1.05,26.49 J1.1 | R2.2 20.31,9.73 20.16,9.73 19.57,9.14 18.81,9.14 U2.12 18.71,9.09 v15.66,9.09
XB_AD0  (via drill 0.3)
  Top 0.152: v18.78,15.27 18.78,14.66 17.77,13.64 v13.58,13.64 | v11.95,13.64 11.95,13.69 6.24,19.41 6.24,19.86 11.44,25.07 17.92,25.07 19.34,26.49 23.05,26.49 J2.20
  Bottom 0.152: v18.78,15.27 18.78,14.66 U2.1 | v11.95,13.64 v13.58,13.64
XB_AD1  (via drill 0.3)
  Top 0.152: v17.54,14.17 16.5,14.17 15.79,14.88 14.06,14.88 13.53,15.42 13.53,19.79 14.74,21.01 14.74,24.36 15.15,24.76 18.05,24.76 18.78,25.5 22.09,25.5 23.05,24.54 J2.19
  Bottom 0.152: v17.54,14.17 17.56,14.15 18.78,14.15 U2.2
XB_AD2  (via drill 0.3)
  Top 0.152: v21.81,19.33 v19.06,16.59
  Bottom 0.152: v19.06,16.59 17.01,14.53 17.01,13.94 17.31,13.64 18.78,13.64 U2.3 | v21.81,19.33 22.16,19.68 22.16,19.71 22.16,21.62 J2.18
XB_AD3  (via drill 0.3)
  Top 0.152: v16.7,15.42 17.13,15.42 22.21,20.5 23.05,20.5 J2.17
  Bottom 0.152: v16.7,15.42 16.7,13.82 17.36,13.16 18.78,13.16 U2.4
XB_AD4  (via drill 0.3)
  Top 0.152: v7.84,15.21 7.84,13.51 14.64,6.71 14.64,4.5 14.8,4.34 23.28,4.34 23.43,4.5 23.43,8.15 23.08,8.51 J2.11
  Bottom 0.152: v7.84,15.21 10.12,15.21 10.78,15.87 10.78,16.64 U2.68
XB_AD5  (via drill 0.3)
  Top 0.152: v20.33,8.94 20.33,11.66 v20.54,11.86 | v20.03,12.88 22.06,14.88 22.06,15.21 22.34,15.47 22.62,15.47 23.05,15.9 J2.15
  Bottom 0.152: v20.33,8.94 19.55,8.15 18.81,8.15 U2.14 | v20.54,11.86 20.54,12.14 20.03,12.65 v20.03,12.88
XB_AD6  (via drill 0.3)
  Top 0.152: v16.83,12.27 23.05,18.49 J2.16
  Bottom 0.152: R1.1 22.97,18.59 J2.16 | v16.83,12.27 15.13,10.57 15.13,8.86 15.43,8.56 15.89,8.56 15.96,8.64 18.78,8.64 U2.13
XB_ASSOC
  Bottom 0.152: R1.2 17.51,18.59 16.32,17.4 16.32,16.66 U2.79
XB_DIN  (via drill 0.3)
  Top 0.152: v6.52,13.59 6.52,16.66 2.27,20.88 2.27,21.64 1.54,21.64 1.05,22.12 J1.3
  Bottom 0.152: v6.52,13.59 6.46,13.64 5.32,13.64 U2.58
XB_DIO7
  Bottom 0.152: U2.71 12.31,15.67 14.82,13.16 14.82,7.9 18.66,4.06 21.76,4.06 21.88,4.19 21.88,5.28 21.53,5.64 21.53,6.73 21.48,6.78 21.48,8.31 23.05,9.88 23.05,10.49 J2.12
XB_DIO8  (via drill 0.3)
  Top 0.152: v11.85,5.51 12.38,6.04 12.38,6.78 v10.3,8.86 | v6.52,10.41 5.63,10.41 3.52,12.52 3.06,12.52 J1.9
  Bottom 0.152: v11.85,5.51 10.33,3.99 10.33,3.15 U2.34 | v10.3,8.86 8.06,8.86 v6.52,10.41
XB_DIO11  (via drill 0.3)
  Top 0.152: v6.52,8 3.29,11.23 v3.29,11.99 | v2.88,13.39 2.17,13.39 J1.7
  Bottom 0.152: v6.52,8 6.52,6.63 6.03,6.15 5.32,6.15 U2.43 | v3.29,11.99 3.29,12.98 v2.88,13.39
XB_DIO12  (via drill 0.3)
  Top 0.152: v6.52,11.61 6.52,12.17 v2.25,16.31
  Bottom 0.152: v6.52,11.61 6.06,11.15 5.32,11.15 U2.53 | v2.25,16.31 2.17,16.41 2.17,16.84 2.17,19.38 1.05,20.5 J1.4
XB_DOUT  (via drill 0.3)
  Top 0.152: v4.86,19.08 4.86,20.7 J1.2
  Bottom 0.152: v4.86,19.08 7.28,16.66 U2.61
XB_EXTRA  (via drill 0.3)
  Top 0.152: v7.02,11 5.47,11 3.65,12.83 1.36,12.83 J1.8
  Bottom 0.152: v7.02,11 7.02,10.74 7.79,9.98 11.37,9.98 16.29,5.05 U2.22
XB_ON  (via drill 0.3)
  Top 0.152: v14.06,18.54 17.87,18.54 v18.45,17.96
  Bottom 0.152: v14.06,18.54 13.96,18.54 12.81,17.4 12.81,16.66 U2.72 | v18.45,17.96 22.16,14.25 22.16,13.41 J2.13
XB_RSSI
  Bottom 0.152: U2.44 5.3,6.63 4.56,6.63 4.31,6.38 4.31,4.34 4.61,4.04 4.61,3.07 4.31,2.77 3.85,2.77 1.94,4.67 1.94,15.62 J1.6
XB_VREF  (via drill 0.3)
  Top 0.152: v16.22,8 16.22,9.73 16.17,9.78 16.17,10.24 16.7,10.77 18.68,10.77 22.42,14.5 J2.14
  Bottom 0.152: v16.22,8 18.07,6.15 18.78,6.15 U2.18

### Text on the board
tPlace: 1
tNames: E | JTAG | F | USB | S | D
tTest: Berkeley | University of California
bTest: openwsn.berkeley.edu